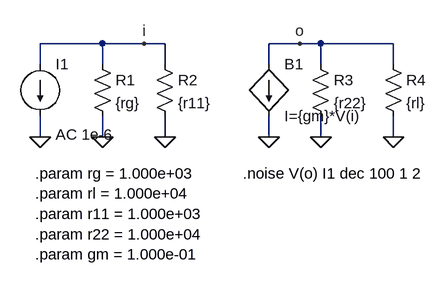
[diagram p0: schematic ejemplo3.asc]
ejemplo3.asc, the LTspice schematic file:
Version 4
SHEET 1 880 680
WIRE 96 96 0 96
WIRE 160 96 96 96
WIRE 192 96 160 96
WIRE 400 96 352 96
WIRE 432 96 400 96
WIRE 544 96 432 96
WIRE 0 128 0 96
WIRE 96 128 96 96
WIRE 192 128 192 96
WIRE 352 128 352 96
WIRE 432 128 432 96
WIRE 544 128 544 96
WIRE 0 240 0 208
WIRE 96 240 96 208
WIRE 192 240 192 208
WIRE 352 240 352 208
WIRE 432 240 432 208
WIRE 544 240 544 208
FLAG 0 240 0
FLAG 96 240 0
FLAG 192 240 0
FLAG 432 240 0
FLAG 544 240 0
FLAG 352 240 0
FLAG 160 96 i
FLAG 400 96 o
SYMBOL current 0 128 R0
WINDOW 123 24 108 Left 2
WINDOW 39 0 0 Left 0
SYMATTR InstName I1
SYMATTR Value ""
SYMATTR Value2 AC 1e-6
SYMBOL res 80 112 R0
SYMATTR InstName R1
SYMATTR Value {rg}
SYMBOL res 176 112 R0
SYMATTR InstName R2
SYMATTR Value {r11}
SYMBOL res 416 112 R0
SYMATTR InstName R3
SYMATTR Value {r22}
SYMBOL res 528 112 R0
SYMATTR InstName R4
SYMATTR Value {rl}
SYMBOL bi 352 128 R0
SYMATTR InstName B1
SYMATTR Value I={gm}*V(i)
TEXT -8 296 Left 2 !.param rg = 1.000e+03\n.param rl = 1.000e+04\n.param r11 = 1.000e+03\n.param r22 = 1.000e+04\n.param gm = 1.000e-01
TEXT 312 296 Left 2 !.noise V(o) I1 dec 100 1 2

The netlist it stands for:
* ejemplo3.asc
I1 i 0 AC 1e-6
R1 i 0 {rg}
R2 i 0 {r11}
R3 o 0 {r22}
R4 o 0 {rl}
B1 o 0 I={gm}*V(i)
.param rg = 1.000e+03
.param rl = 1.000e+04
.param r11 = 1.000e+03
.param r22 = 1.000e+04
.param gm = 1.000e-01
.noise V(o) I1 dec 100 1 2
.backanno
.end